# EAGLE design SATCOM_LEVELSHIFTER (EAGLE 8.4.1)
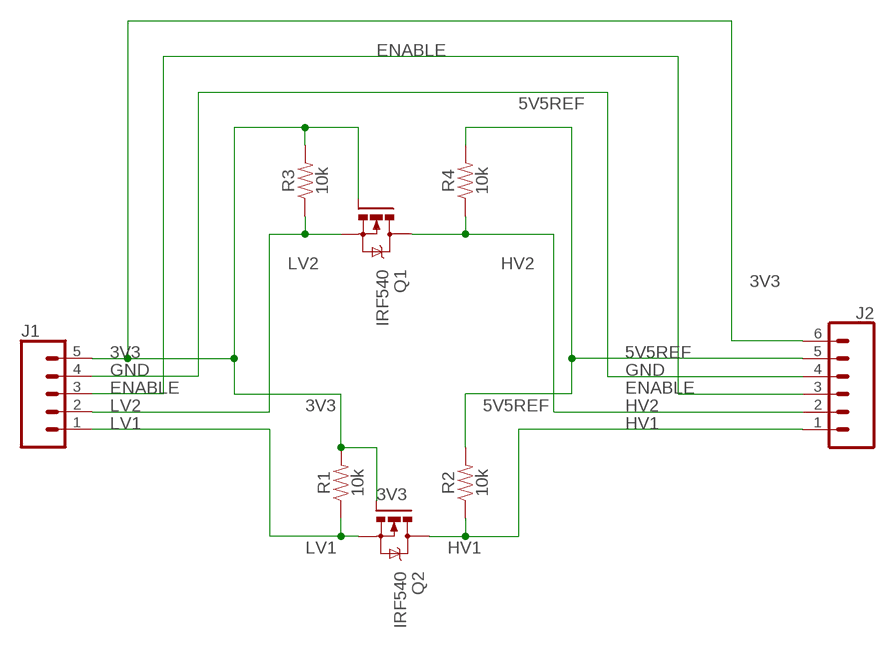
[diagram p0: schematic, sheet 1]

## Parts
J1  CONN_05PTH_LONGPADS  [1X05_LONGPADS]
J2  CONN_06LONGPADS  [1X06_LONGPADS]
Q1  IRF540  [TO220BV]
Q2  IRF540  [TO220BV]
R1  10k  10KOHM-HORIZ_KIT-1/4W-1%  [AXIAL-0.3-KIT]
R2  10k  10KOHM-HORIZ_KIT-1/4W-1%  [AXIAL-0.3-KIT]
R3  10k  10KOHM-HORIZ_KIT-1/4W-1%  [AXIAL-0.3-KIT]
R4  10k  10KOHM-HORIZ_KIT-1/4W-1%  [AXIAL-0.3-KIT]

## Nets
3V3: J1.5 J2.6 Q1.G Q2.G R1.P$2 R3.P$2
5V5REF: J2.5 R2.P$2 R4.P$2
ENABLE: J1.3 J2.3
GND: J1.4 J2.4
HV1: J2.1 Q2.D R2.P$1
HV2: J2.2 Q1.D R4.P$1
LV1: J1.1 Q2.S R1.P$1
LV2: J1.2 Q1.S R3.P$1

## Library data of the parts
J1 = SparkFun-Connectors:CONN_05: Multi connection point. Often used as Generic Header-pin footprint for 0.1 inch spaced/style header connections On any of the 0.1 inch spaced packages, you can populate with these: Break Away Headers - Straight <https://www.sparkfun.com/products/116> (PRT-00116) Break Away Male Headers - Right Angle <https://www.sparkfun.com/products/553> (PRT-00553) Female Headers <https://www.sparkfun.com/products/115> (PRT-00115) Break Away Headers - Machine Pin <https://www.sparkfun.com/products/117> (PRT-00117) Break Away Female Headers - Swiss Machine Pin <https://www.sparkfun.com/products/743> (PRT-00743) For SCREWTERMINALS and SPRING TERMINALS visit here: Screw Terimnals on SparkFun.com <https://www.sparkfun.com/search/results?term=Screw+Terminals> (5mm/3.5mm/2.54mm spacing) This device is also useful as a general connection point to wire up your design to another part of your project. Our various solder wires solder well into these plated through hole pads. Hook-Up Wire - Assortment (Stranded, 22 AWG) <https://www.sparkfun.com/products/11375> (PRT-11375) Hook-Up Wire - Assortment (Solid Core, 22 AWG) <https://www.sparkfun.com/products/11367> (PRT-11367) View the entire wire category on our website here <https://www.sparkfun.com/categories/141> Special notes: Molex polarized connector foot print use with SKU : PRT-08231 with associated crimp pins and housings. 1MM SMD Version SKU: PRT-10208
J2 = SparkFun-Connectors:CONN_06: Multi connection point. Often used as Generic Header-pin footprint for 0.1 inch spaced/style header connections On any of the 0.1 inch spaced packages, you can populate with these: Break Away Headers - Straight <https://www.sparkfun.com/products/116> (PRT-00116) Break Away Male Headers - Right Angle <https://www.sparkfun.com/products/553> (PRT-00553) Female Headers <https://www.sparkfun.com/products/115> (PRT-00115) Break Away Headers - Machine Pin <https://www.sparkfun.com/products/117> (PRT-00117) Break Away Female Headers - Swiss Machine Pin <https://www.sparkfun.com/products/743> (PRT-00743) Arduino Stackable Header - 6 Pin <https://www.sparkfun.com/products/9280> (PRT-09280) For SCREWTERMINALS and SPRING TERMINALS visit here: Screw Terimnals on SparkFun.com <https://www.sparkfun.com/search/results?term=Screw+Terminals> (5mm/3.5mm/2.54mm spacing) This device is also useful as a general connection point to wire up your design to another part of your project. Our various solder wires solder well into these plated through hole pads. Hook-Up Wire - Assortment (Stranded, 22 AWG) <https://www.sparkfun.com/products/11375> (PRT-11375) Hook-Up Wire - Assortment (Solid Core, 22 AWG) <https://www.sparkfun.com/products/11367> (PRT-11367) View the entire wire category on our website here <https://www.sparkfun.com/categories/141>
Q1 Q2 = transistor-power:IRF540: HEXFET Power MOSFET
R1-R4 = SparkFun-Resistors:10KOHM: 10kΩ resistor A resistor is a passive two-terminal electrical component that implements electrical resistance as a circuit element. Resistors act to reduce current flow, and, at the same time, act to lower voltage levels within circuits. - Wikipedia; PROD_ID: RES-12183

## Net classes
0 default: width 0.8 mm

## Board
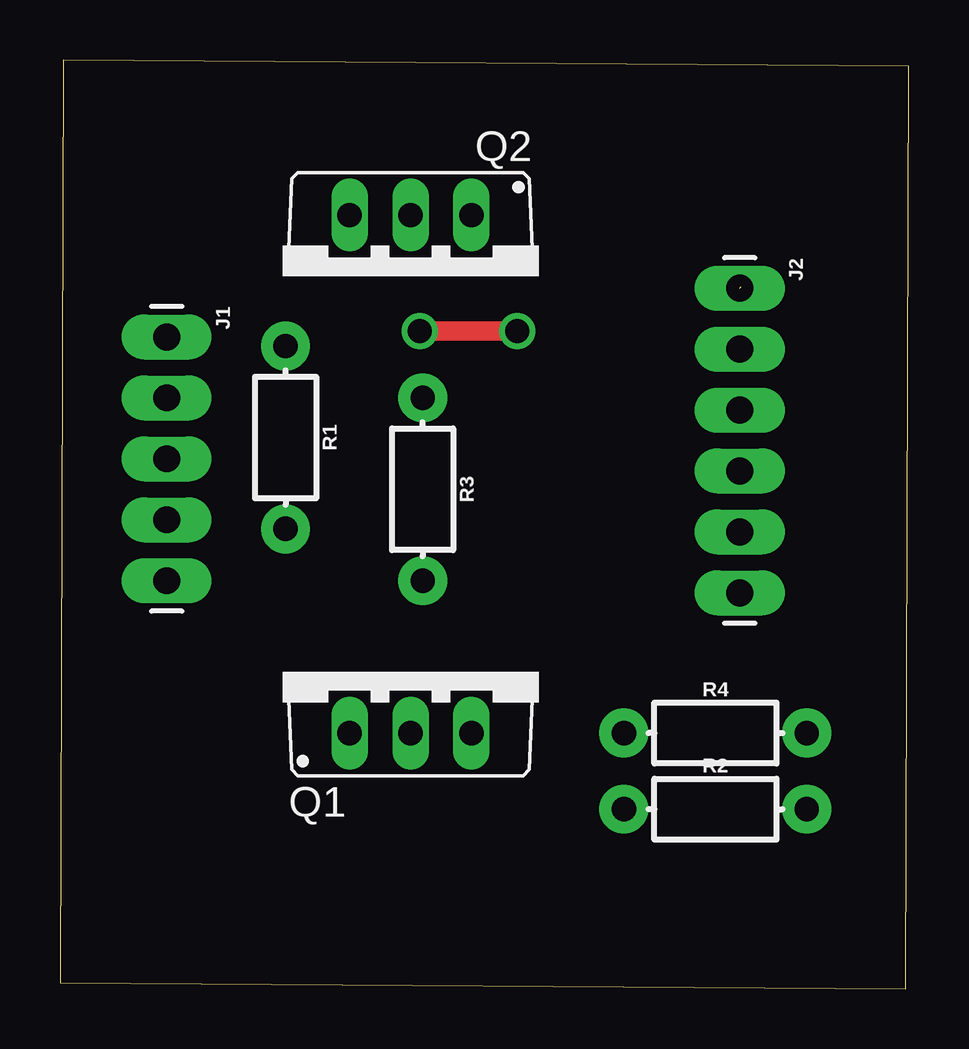
[diagram p1: board, top side]
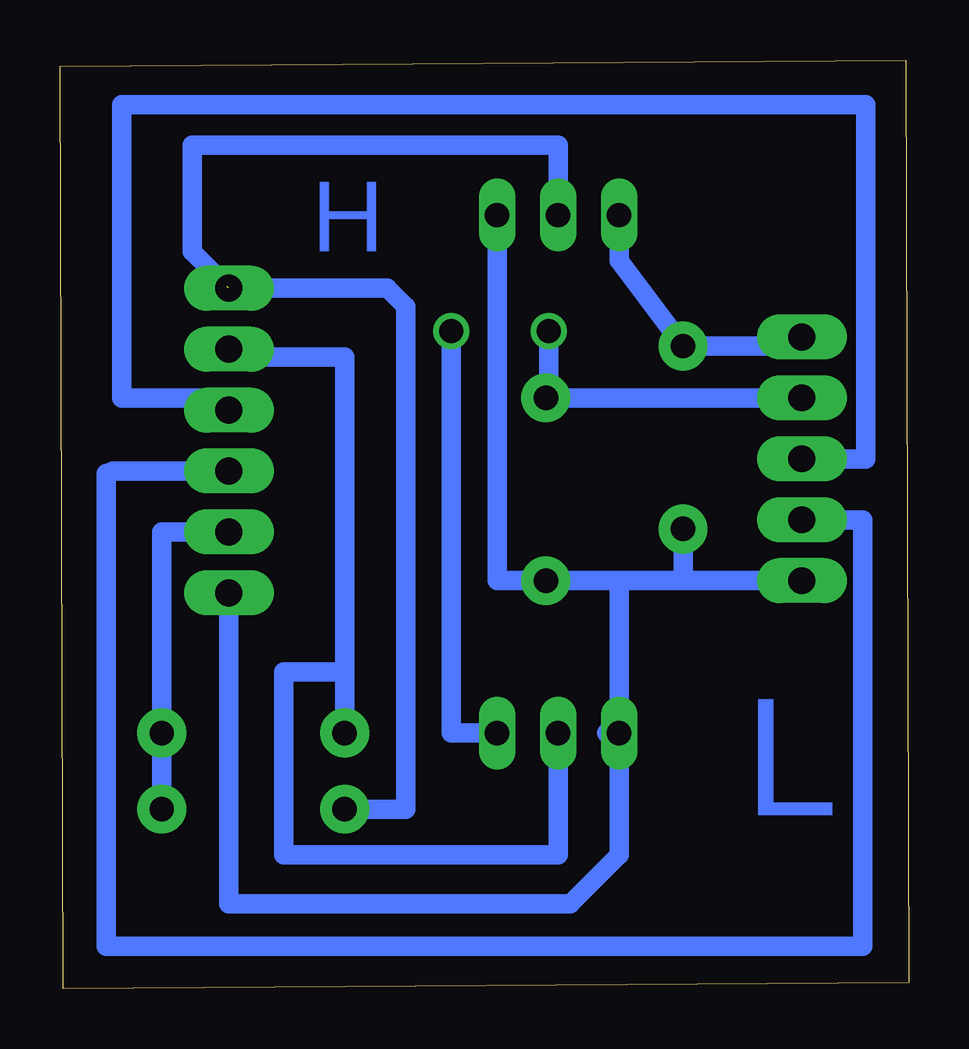
[diagram p2: board, bottom side, seen from below]

Size 35.36 x 38.73 mm. Coordinates in mm from the lower left corner, seen from the top.
Outline: 0,0.25 35.23,0 35.36,38.47 0.13,38.73 0,0.25
Copper layers (1*16): Top 0.035mm / dielectric 1.5mm / Bottom 0.035mm
Design rules "default": minimum track width 6mil, minimum drill 0.35mm, track to track 6mil, track to pad 6mil, pad to pad 6mil, via to via 6mil, smd to smd 6mil, copper to edge 40mil, drill to drill 6mil, minimum pad ring 10mil, minimum via ring 8mil, stop-mask expansion 4mil, vias tented up to drill 0mil, thermal gap 10mil

### Footprints (pad centres in the part's own frame; a part is rotated, then mirrored left to right if it is on the bottom)
1X05_LONGPADS = drill 1.118 pad 1.88 long: 1 0,0; 2 2.54,0; 3 5.08,0; 4 7.62,0; 5 10.16,0
1X06_LONGPADS = drill 1.118 pad 1.88 long: 1 0,0; 2 2.54,0; 3 5.08,0; 4 7.62,0; 5 10.16,0; 6 12.7,0
TO220BV = drill 1.016 long: D 0,-2.54; G -2.54,-2.54; S 2.54,-2.54
AXIAL-0.3-KIT = drill 1.016 pad 2.032: P$1 -3.81,0; P$2 3.81,0

### Placement (x,y rotation side)
J1  4.45,27.18 270 top
J2  28.32,29.21 270 top
Q1  14.61,13.21 0 top
Q2  14.61,29.72 180 top
R1  9.4,22.99 270 top
R2  27.31,7.49 0 top
R3  15.11,20.83 270 top
R4  27.31,10.67 0 top

### Tracks (layer width: path | path; a pad name or v marks a point on that pad's centre or on a via)
3V3
  Bottom 0.813: Q1.G 12.57,10.67 | R1.P$2 9.4,17.02 | 12.07,17.02 9.4,17.02 | 12.07,17.02 R3.P$2 17.14,17.02 Q2.G | Q1.G 12.07,17.02 | 9.4,17.02 J1.5 | J2.6 28.32,3.56 14.1,3.56 12.07,5.59 Q1.G
5V5REF
  Bottom 0.813: R2.P$2 R4.P$2 31.11,19.05 J2.5
ENABLE
  Bottom 0.813: J1.3 1.78,22.1 1.78,36.86 32.79,36.85 32.79,24.64 28.83,24.64 J2.3
GND
  Bottom 0.813: J1.4 1.91,19.56 1.91,1.78 33.43,1.78 33.43,21.49 33.15,21.59 J2.4
HV1  (1 unrouted)
  Bottom 0.813: R2.P$1 20.96,7.49 20.96,28.45 21.72,29.21 J2.1 | Q2.D 14.61,35.18 29.85,35.18 29.85,30.73 28.39,29.28
HV2
  Bottom 0.813: 23.5,13.21 23.5,26.35 28,26.35 J2.2 | R4.P$1 23.5,13.21 | 23.5,13.21 26.04,13.21 26.04,5.59 14.61,5.59 Q1.D
LV1
  Bottom 0.813: Q2.S 12.07,30.35 R1.P$1 4.83,26.8 J1.1
LV2  (via drill 1)
  Top 0.813: v14.99,27.43 v19.05,27.43
  Bottom 0.813: v19.05,27.43 19.05,10.67 Q1.S | v14.99,27.43 14.99,24.64 R3.P$1 J1.2

### Text on the board
Bottom: H | L